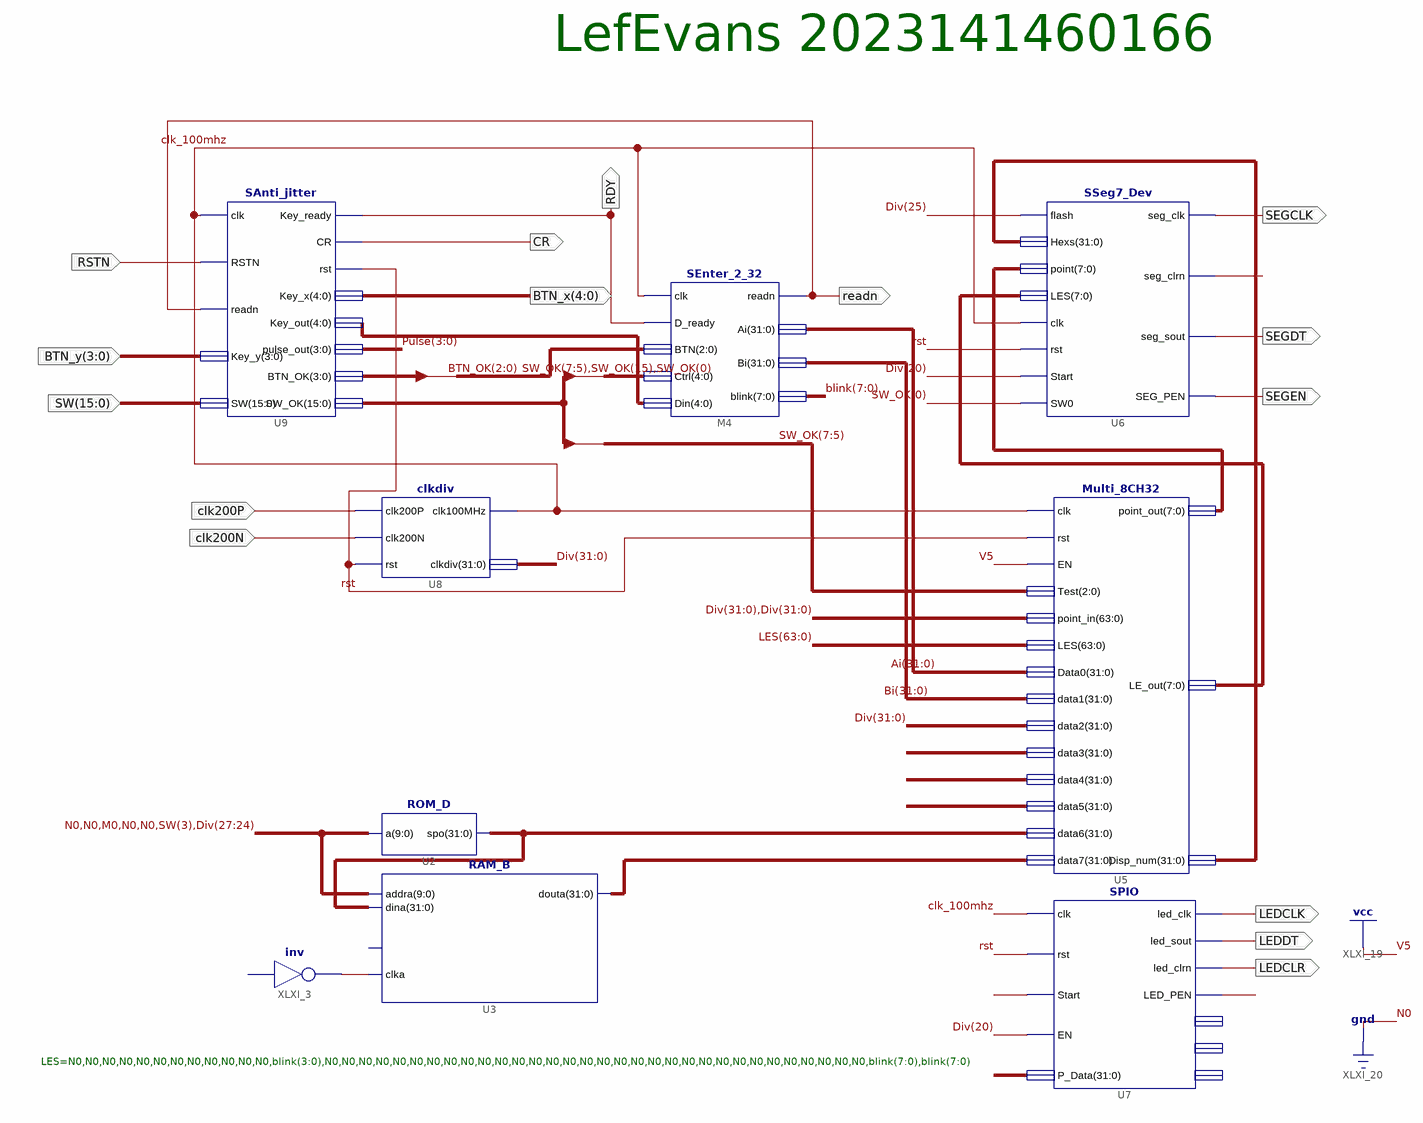
[diagram p0: schematic sheet 1]
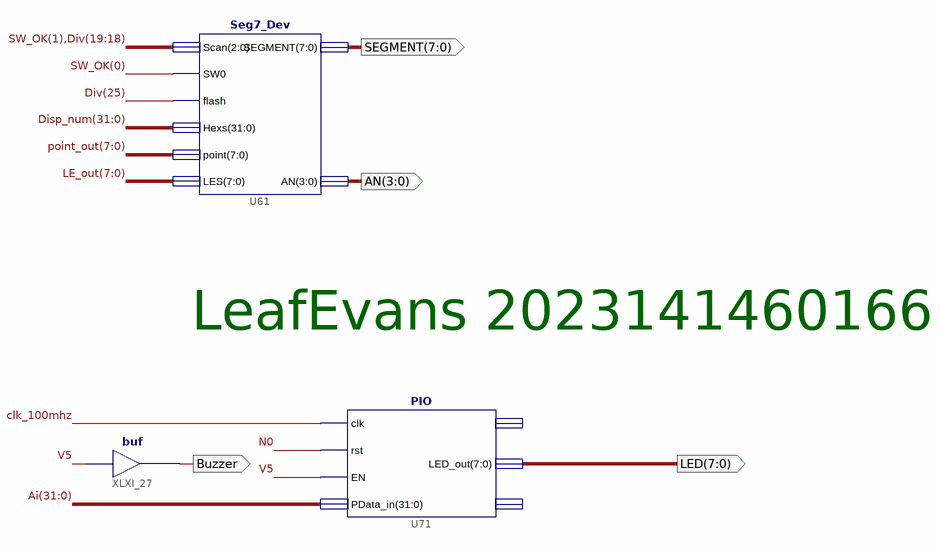
[diagram p1: schematic sheet 2]
// Xilinx ISE schematic Sseg7.sch (kintex7) as structural Verilog: 12 symbols, 19 ports
module Sseg7 (
  input  clk200P,
  input  clk200N,
  input  RSTN,
  input  [3:0] BTN_y,
  input  [15:0] SW,
  output LEDCLR,
  output LEDDT,
  output LEDCLK,
  output SEGCLK,
  output SEGDT,
  output SEGEN,
  output [4:0] BTN_x,
  output RDY,
  output CR,
  output readn,
  output Buzzer,
  output [7:0] LED,
  output [7:0] SEGMENT,
  output [3:0] AN
);

  wire clk_100mhz, M0, rst, XLXN_1, XLXN_40, XLXN_43, XLXN_57;
  wire [3:0] BTN_OK, Pulse;
  wire [4:0] XLXN_100;
  wire [7:0] blink, LE_out, point_out, XLXN_51, XLXN_52;
  wire [15:0] SW_OK;
  wire [31:0] Ai, Bi, Disp_num, Div, XLXN_19, XLXN_35, XLXN_42, XLXN_49, XLXN_95, XLXN_96, XLXN_97;
  wire [63:0] LES;

  SPIO U7 (
    .clk(clk_100mhz), .rst(rst), .Start(XLXN_40), .EN(Div[20]), .P_Data(XLXN_42), .led_clk(LEDCLK),
    .led_sout(LEDDT), .led_clrn(LEDCLR), .LED_PEN(XLXN_43));  // open: counter_set, LED_out, GPIOf0
  Multi_8CH32 U5 (
    .clk(clk_100mhz), .rst(rst), .EN(1'b1), .Test(SW_OK[7:5]), .point_in({Div, Div}), .LES(LES), .Data0(Ai),
    .data1(Bi), .data2(Div), .data3(XLXN_95), .data4(XLXN_96), .data5(XLXN_97), .data6(XLXN_19),
    .data7(XLXN_35), .point_out(XLXN_51), .LE_out(XLXN_52), .Disp_num(XLXN_49));
  RAM_B U3 (
    .addra({2'b00, M0, 2'b00, SW[3], Div[27:24]}), .dina(XLXN_19), .clka(XLXN_1), .douta(XLXN_35));  // open: wea
  // inv XLXI_3 has open pins: I=open, O=XLXN_1
  ROM_D U2 (.a({2'b00, M0, 2'b00, SW[3], Div[27:24]}), .spo(XLXN_19));
  SSeg7_Dev U6 (
    .seg_sout(SEGDT), .seg_clrn(XLXN_57), .seg_clk(SEGCLK), .SEG_PEN(SEGEN), .flash(Div[25]), .LES(XLXN_52),
    .Hexs(XLXN_49), .point(XLXN_51), .clk(clk_100mhz), .SW0(SW_OK[0]), .rst(rst), .Start(Div[20]));
  clkdiv U8 (.clk200P(clk200P), .clk200N(clk200N), .rst(rst), .clk100MHz(clk_100mhz), .clkdiv(Div));
  SEnter_2_32 M4 (
    .clk(clk_100mhz), .D_ready(RDY), .BTN(BTN_OK[2:0]), .Ctrl({SW_OK[7:5], SW_OK[15], SW_OK[0]}),
    .Din(XLXN_100), .readn(readn), .Ai(Ai), .Bi(Bi), .blink(blink));
  SAnti_jitter U9 (
    .clk(clk_100mhz), .RSTN(RSTN), .readn(readn), .Key_y(BTN_y), .SW(SW), .Key_ready(RDY), .CR(CR),
    .rst(rst), .Key_x(BTN_x), .Key_out(XLXN_100), .pulse_out(Pulse), .BTN_OK(BTN_OK), .SW_OK(SW_OK));
  Seg7_Dev U61 (
    .SW0(SW_OK[0]), .LES(LE_out), .point(point_out), .Scan({SW_OK[1], Div[19:18]}), .Hexs(Disp_num),
    .flash(Div[25]), .AN(AN), .SEGMENT(SEGMENT));
  PIO U71 (.clk(clk_100mhz), .rst(1'b0), .EN(1'b1), .PData_in(Ai), .LED_out(LED));  // open: counter_set, GPIOf0
  buf XLXI_27 (Buzzer, 1'b1);

  // Notes on the sheet:
  //   LefEvans 2023141460166
  //   LES=N0,N0,N0,N0,N0,N0,N0,N0,N0,N0,N0,N0,blink(3:0),N0,N0,N0,N0,N0,N0,N0,N0,N0,N0,N0,N0,N0,N0,N0,N0,N0,N0,N0,N0,N0,N0,N0,N0,N0,N0,N0,N0,N0,N0,N0,N0,blink(7:0),blink(7:0)
  //   LeafEvans 2023141460166
endmodule
